# EAGLE design IO BOARD BOTTOM (EAGLE 9.6.2)
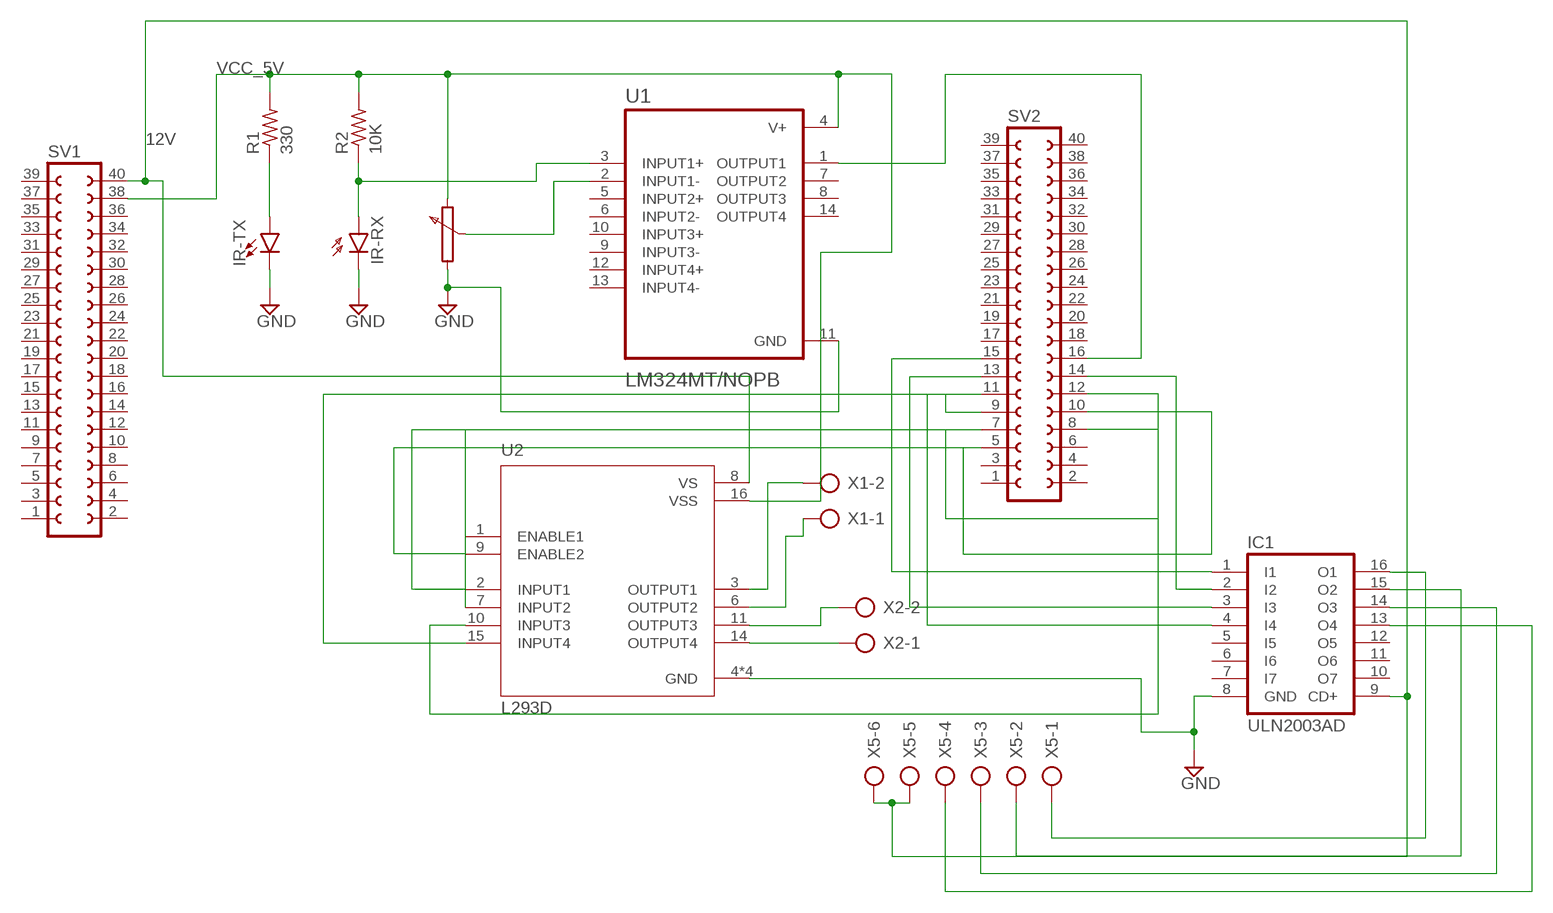
[diagram p0: schematic, sheet 1]

## Parts
IC1  ULN2003AD  [SO16]
IR-RX  SFH205  [SFH205]
IR-TX  LED-IRTSAL6100  [LED_5MM]
R1  330  R-US_0204/2V  [0204V]
R2  10K  R-US_0204/2V  [0204V]
SV1  FE20-2  [FE20-2]
SV2  FE20-2  [FE20-2]
U1  LM324MT/NOPB  [SOP65P640X120-14N]
U2  L293D  [DIP880W50P254L2000H510Q16]
X1  AK500/2  [AK500/2]
X2  AK500/2  [AK500/2]
X5  AK500/6  [AK500/6]

## Nets
12V: IC1.9(CD+) SV1.40 U2.8(VS) X5.5 X5.6
GND: IC1.8(GND) IR-RX.K(C) IR-TX.K(C) U1.11(GND) U2.4(GND) U2.5(GND) U2.12(GND) U2.13(GND)
N$1: IR-TX.A R1.1
N$2: IR-RX.A R2.1 U1.3(INPUT1+)
N$3: U1.2(INPUT1-)
N$4: SV2.16 U1.1(OUTPUT1)
N$5: SV2.8 U2.1(ENABLE1)
N$6: SV2.10 U2.9(ENABLE2)
N$7: SV2.7 U2.2(INPUT1)
N$8: SV2.5 U2.7(INPUT2)
N$9: SV2.12 U2.10(INPUT3)
N$10: SV2.9 U2.15(INPUT4)
N$11: U2.3(OUTPUT1) X1.2
N$12: U2.6(OUTPUT2) X1.1
N$13: U2.11(OUTPUT3) X2.2
N$14: U2.14(OUTPUT4) X2.1
N$15: IC1.1(I1) SV2.15
N$17: IC1.2(I2) SV2.14
N$18: IC1.3(I3) SV2.13
N$19: IC1.4(I4) SV2.11
N$20: IC1.16(O1) X5.1
N$21: IC1.15(O2) X5.2
N$22: IC1.14(O3) X5.3
N$23: IC1.13(O4) X5.4
VCC_5V: R1.2 R2.2 SV1.38 U1.4(V+) U2.16(VSS)
Unconnected: IC1.5(I5) IC1.6(I6) IC1.7(I7) IC1.10(O7) IC1.11(O6) IC1.12(O5) SV1.1 SV1.2 SV1.3 SV1.4 SV1.5 SV1.6 SV1.7 SV1.8 SV1.9 SV1.10 SV1.11 SV1.12 SV1.13 SV1.14 SV1.15 SV1.16 SV1.17 SV1.18 SV1.19 SV1.20 SV1.21 SV1.22 SV1.23 SV1.24 SV1.25 SV1.26 SV1.27 SV1.28 SV1.29 SV1.30 SV1.31 SV1.32 SV1.33 SV1.34 SV1.35 SV1.36 SV1.37 SV1.39 SV2.1 SV2.2 SV2.3 SV2.4 SV2.6 SV2.17 SV2.18 SV2.19 SV2.20 SV2.21 SV2.22 SV2.23 SV2.24 SV2.25 SV2.26 SV2.27 SV2.28 SV2.29 SV2.30 SV2.31 SV2.32 SV2.33 SV2.34 SV2.35 SV2.36 SV2.37 SV2.38 SV2.39 SV2.40 U1.5(INPUT2+) U1.6(INPUT2-) U1.7(OUTPUT2) U1.8(OUTPUT3) U1.9(INPUT3-) U1.10(INPUT3+) U1.12(INPUT4+) U1.13(INPUT4-) U1.14(OUTPUT4)

## Library data of the parts
IC1 = ULN2003A:ULN2003A: DRIVER ARRAY Check prices <https://pricing.snapeda.com/search/part/ULN2003A/?ref=eda>; AVAILABILITY: Good; DESCRIPTION: Bipolar (BJT) Transistor Array 7 NPN Darlington 50V 500mA Through Hole 16-DIP; MF: STMicroelectronics; MP: ULN2003A; PACKAGE: DIP-16 STMicroelectronics; PRICE: None; PURCHASE-URL: https://pricing.snapeda.com/search/part/ULN2003A/?ref=eda
IR-RX = opto-trans-siemens:SFH205: PHOTO DIODE; OC_FARNELL: unknown; OC_NEWARK: unknown
IR-TX = SparkFun-LED:LED-IR: Infrared LED (IR) Wavelength: 940nm Packages: TSAL6100 LTE302 - Side firing. Check SparkFun-Sensors.lbr for the receiver SparkFun Products: ZX Distance and Gesture Sensor <[https://www.sparkfun.com/products/12780]> Infrared Emitters and Detectors <https://www.sparkfun.com/products/241>; PROD_ID: DIO-12058
R1 R2 = rcl:R-US_: RESISTOR, American symbol; SPICEPREFIX: R
SV1 SV2 = con-lsta:FE20-2: FEMALE HEADER; OC_FARNELL: unknown; OC_NEWARK: unknown
U1 = LM324MT_NOPB:LM324MT/NOPB: Check prices <https://pricing.snapeda.com/search/part/LM324MT/?ref=eda>; AVAILABILITY: Bad; DESCRIPTION: General Purpose Amplifier 4 Circuit 14-TSSOP; MF: Texas Instruments; MP: LM324MT; PACKAGE: TSSOP-14 Texas Instruments; PRICE: None
U2 = L293D:L293D: 4-Channel Motor Driver 24V 16-Pin Power PDIP Tube Check prices <https://pricing.snapeda.com/search/part/L293D/?ref=eda>; AVAILABILITY: Good; DESCRIPTION: Bipolar Motor Driver Parallel 20-SOIC; MF: STMicroelectronics; MP: L293D; PACKAGE: DIP-16 STMicroelectronics; PRICE: None; PURCHASE-URL: https://pricing.snapeda.com/search/part/L293D/?ref=eda
X1 X2 = con-ptr500:AK500/2: CONNECTOR; OC_FARNELL: unknown; OC_NEWARK: unknown
X5 = con-ptr500:AK500/6: CONNECTOR; OC_FARNELL: unknown; OC_NEWARK: unknown

## Board
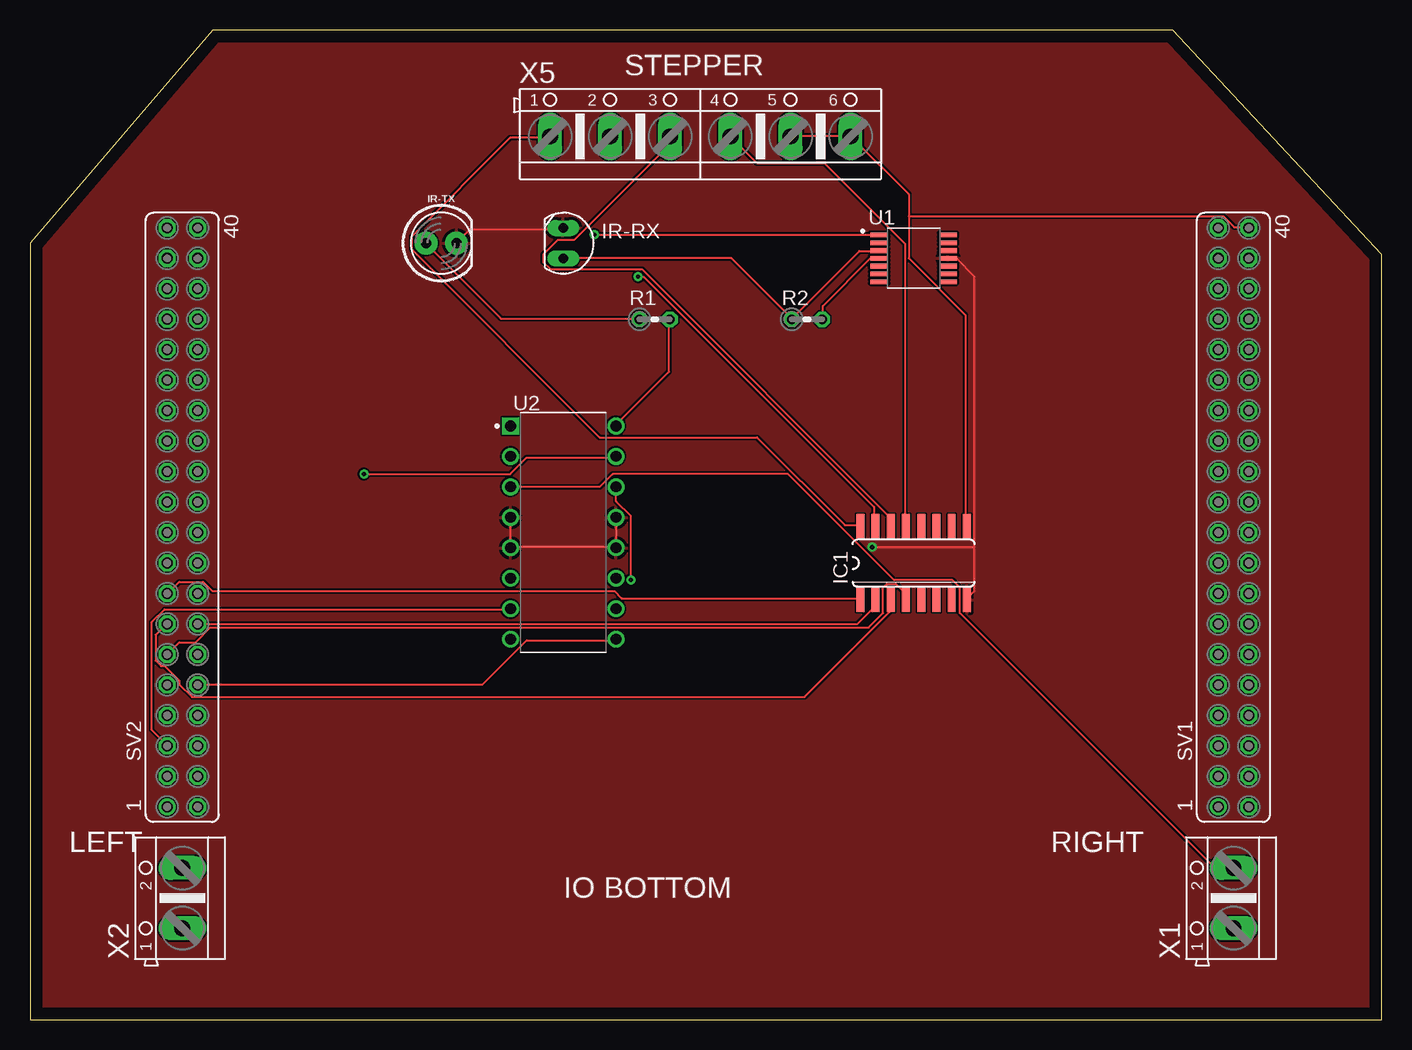
[diagram p1: board, top side]
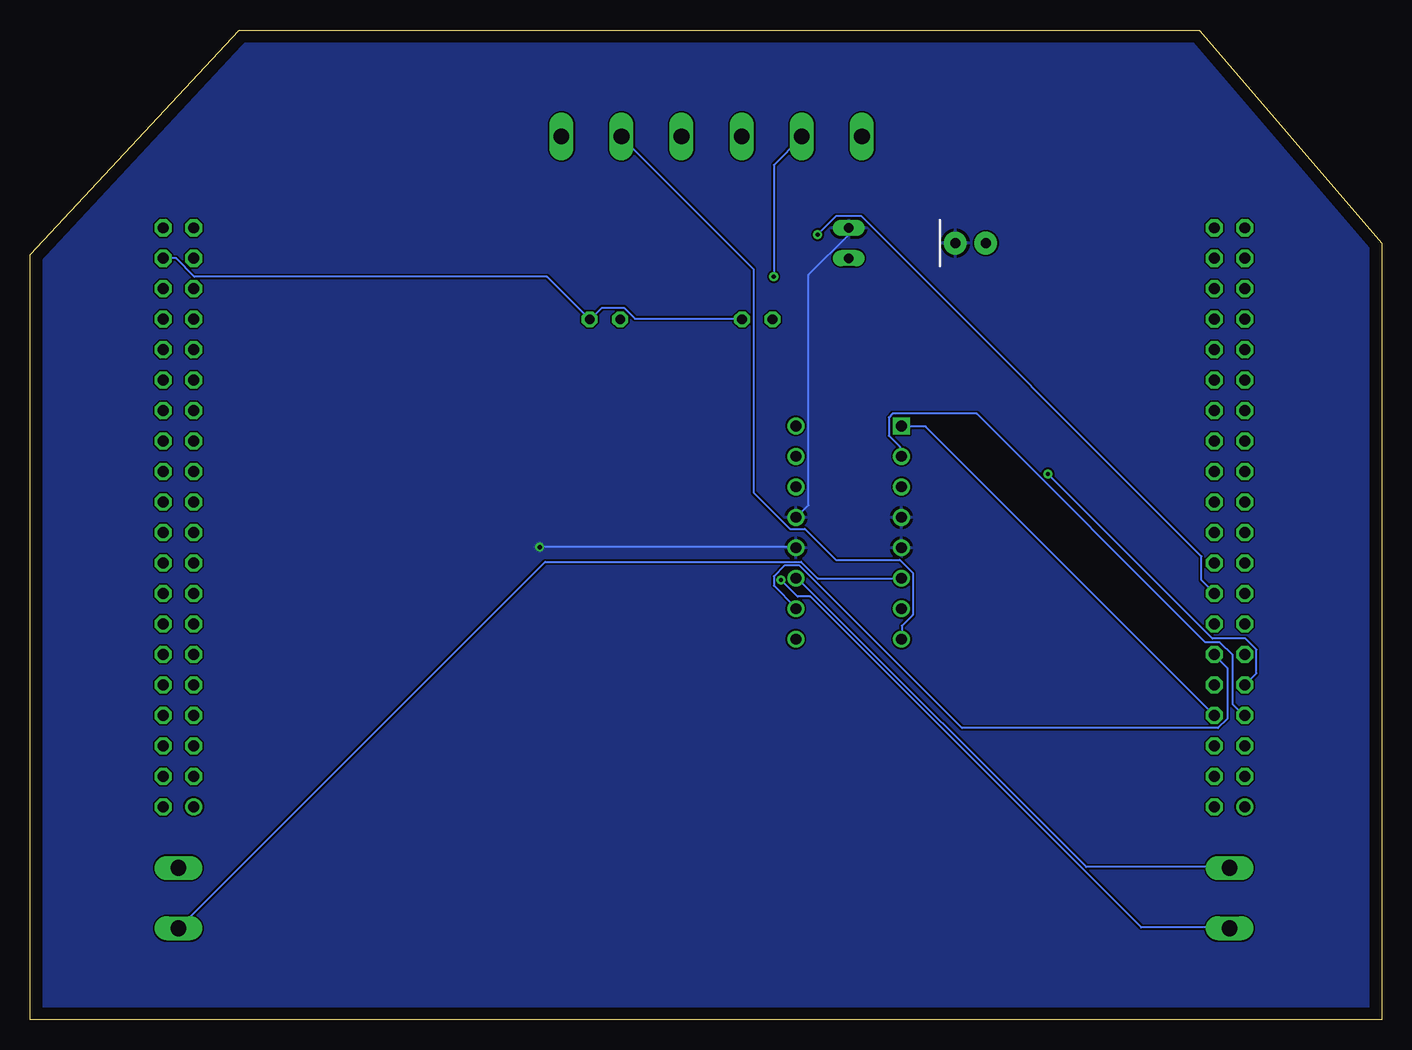
[diagram p2: board, bottom side, seen from below]

Size 112.7 x 82.54 mm. Coordinates in mm from the lower left corner, seen from the top.
Outline: 0,0 112.7,0 112.7,63.83 95.26,82.54 15.23,82.54 0,64.77 0,0
Copper layers (1*16): Top 0.035mm / dielectric 1.5mm / Bottom 0.035mm
Design rules "default": minimum track width 6mil, minimum drill 0.35mm, track to track 6mil, track to pad 6mil, pad to pad 6mil, via to via 6mil, smd to smd 6mil, copper to edge 40mil, drill to drill 6mil, minimum pad ring 10mil, minimum via ring 8mil, stop-mask expansion 4mil, vias tented up to drill 0mil, thermal gap 10mil

### Footprints (pad centres in the part's own frame; a part is rotated, then mirrored left to right if it is on the bottom)
SO16 = smd 0.66 x 2.032: 1 -4.445,-3.073; 2 -3.175,-3.073; 3 -1.905,-3.073; 4 -0.635,-3.073; 5 0.635,-3.073; 6 1.905,-3.073; 7 3.175,-3.073; 8 4.445,-3.073; 9 4.445,3.073; 10 3.175,3.073; 11 1.905,3.073; 12 0.635,3.073; 13 -0.635,3.073; 14 -1.905,3.073; 15 -3.175,3.073; 16 -4.445,3.073
SFH205 = drill 0.813 long: A 0,-1.27; K 0,1.27
LED_5MM = drill 0.813 pad 1.88: A -1.27,0; K 1.27,0
0204V = drill 0.813 octagon: 1 -1.27,0; 2 1.27,0
FE20-2 = drill 0.914: 1 -24.13,1.27 | drill 0.914 octagon: 2 -24.13,-1.27; 3 -21.59,1.27; 4 -21.59,-1.27; 5 -19.05,1.27; 6 -19.05,-1.27; 7 -16.51,1.27; 8 -16.51,-1.27; 9 -13.97,1.27; 10 -13.97,-1.27; 11 -11.43,1.27; 12 -11.43,-1.27; 13 -8.89,1.27; 14 -8.89,-1.27; 15 -6.35,1.27; 16 -6.35,-1.27; 17 -3.81,1.27; 18 -3.81,-1.27; 19 -1.27,1.27; 20 -1.27,-1.27; 21 1.27,1.27; 22 1.27,-1.27; 23 3.81,1.27; 24 3.81,-1.27; 25 6.35,1.27; 26 6.35,-1.27; 27 8.89,1.27; 28 8.89,-1.27; 29 11.43,1.27; 30 11.43,-1.27; 31 13.97,1.27; 32 13.97,-1.27; 33 16.51,1.27; 34 16.51,-1.27; 35 19.05,1.27; 36 19.05,-1.27; 37 21.59,1.27; 38 21.59,-1.27; 39 24.13,1.27; 40 24.13,-1.27
SOP65P640X120-14N = smd 1.57 x 0.41: 1 -2.87,1.95; 2 -2.87,1.3; 3 -2.87,0.65; 4 -2.87,0; 5 -2.87,-0.65; 6 -2.87,-1.3; 7 -2.87,-1.95; 8 2.87,-1.95; 9 2.87,-1.3; 10 2.87,-0.65; 11 2.87,0; 12 2.87,0.65; 13 2.87,1.3; 14 2.87,1.95
DIP880W50P254L2000H510Q16 = drill 0.9 pad 1.25 square: 1 -4.4,8.89 | drill 0.9 pad 1.25: 2 -4.4,6.35; 3 -4.4,3.81; 4 -4.4,1.27; 5 -4.4,-1.27; 6 -4.4,-3.81; 7 -4.4,-6.35; 8 -4.4,-8.89; 9 4.4,-8.89; 10 4.4,-6.35; 11 4.4,-3.81; 12 4.4,-1.27; 13 4.4,1.27; 14 4.4,3.81; 15 4.4,6.35; 16 4.4,8.89
AK500/2 = drill 1.321 long: 1 -2.515,0; 2 2.515,0
AK500/6 = drill 1.321 long: 1 -12.522,0; 2 -7.518,0; 3 -2.515,0; 4 2.515,0; 5 7.518,0; 6 12.522,0

### Placement (x,y rotation side)
IC1  73.66,38.1 0 top
IR-RX  44.45,64.77 0 top
IR-TX  34.29,64.77 0 top
R1  52.07,58.42 0 top
R2  64.77,58.42 0 top
SV1  100.33,41.91 90 top
SV2  12.7,41.91 90 top
U1  73.66,63.5 0 top
U2  44.45,40.64 0 top
X1  100.33,10.16 90 top
X2  12.7,10.16 90 top
X5  55.88,73.66 0 top

### Tracks (layer width: path | path; a pad name or v marks a point on that pad's centre or on a via)
12V
  Top 0.152: 73.25,67.01 73.25,68.83 68.53,73.56 X5.6 68.38,73.71 63.5,73.71 X5.5 | 73.25,67.01 73.25,63.5 77.98,58.78 77.98,41.25 IC1.9 | 73.25,67.01 99.47,67.01 100.38,66.09 101.6,66.09 SV1.40
  Bottom 0.152: U2.8 40.03,31.8 40.03,32.87 39.12,33.78 39.12,37.29 40.18,38.35 45.52,38.35 48.11,40.95 49.33,40.95 52.38,43.99 52.38,62.59 63.35,73.56 X5.5
GND  (via drill 0.35)
  Top 0.152: U1.11 77.22,63.5 78.74,61.98 78.74,39.42 | 78.74,39.42 78.74,35.76 78.13,35.15 IC1.8 | IR-RX.K 44.45,65.94 36.68,65.94 35.61,64.87 IR-TX.K | U2.4 40.03,41.86 40.03,39.42 U2.5 40.18,39.42 48.72,39.42 U2.12 48.87,39.42 48.87,41.86 U2.13 | v70.21,39.42 78.74,39.42
  Bottom 0.152: IR-RX.K 44.45,65.48 47.8,62.13 47.8,42.93 48.72,42.01 U2.13 | v70.21,39.42 48.87,39.42 U2.12
  pour Top: 11.43,85.09 111.76,85.09 121.92,74.93 121.92,-5.08 -2.54,-5.08 -10.16,2.54 -10.16,63.5
  pour Bottom: 8.89,88.9 118.11,88.9 132.08,74.93 132.08,-5.08 130.81,-6.35 128.27,-8.89 -8.89,-8.89 -16.51,-1.27 -16.51,63.5
N$1
  Top 0.152: R1.1 50.7,58.47 39.27,58.47 33.02,64.72 IR-TX.A
N$2
  Top 0.152: 63.5,58.47 69.14,64.11 70.66,64.11 U1.3 | IR-RX.A 58.47,63.5 63.5,58.47 | 63.5,58.47 R2.1
N$4  (via drill 0.35)
  Top 0.152: v47.04,65.48 70.66,65.48 U1.1
  Bottom 0.152: v47.04,65.48 45.52,67.01 43.38,67.01 15.04,38.66 15.04,36.68 13.97,35.61 SV2.16
N$5
  Bottom 0.152: SV2.8 38.05,49.48 40.03,49.48 U2.1
N$6
  Top 0.152: U2.9 48.72,31.65 41.4,31.65 37.74,27.99 13.97,27.99 SV2.10
N$7
  Bottom 0.152: U2.2 40.18,47.04 40.18,47.8 41.1,48.72 41.1,50.24 40.79,50.55 33.78,50.55 14.73,31.5 13.51,31.5 12.45,30.43 12.45,26.31 11.53,25.4 SV2.7
N$8
  Top 0.152: U2.7 40.03,34.24 11.23,34.24 10.16,33.17 10.16,24.18 11.38,22.96 SV2.5
N$9
  Bottom 0.152: U2.10 48.87,34.39 50.7,36.22 50.7,36.98 49.78,37.9 48.57,37.9 35,24.33 13.66,24.33 12.9,25.09 12.9,29.36 13.97,30.43 SV2.12
N$10  (via drill 0.35)
  Top 0.152: v27.84,45.52 40.03,45.52 41.4,46.89 48.72,46.89 U2.15
  Bottom 0.152: v27.84,45.52 14.12,31.8 11.38,31.8 10.46,30.89 10.46,28.9 SV2.9
N$11
  Top 0.152: U2.3 47.5,44.45 48.57,45.52 63.2,45.52 72.03,36.68 76.91,36.68 77.52,36.07 77.52,33.93 98.7,12.75 100.23,12.75 X1.2
N$12
  Bottom 0.152: U2.6 47.04,36.83 48.41,38.2 69.75,38.2 100.23,7.72 X1.1
N$13
  Bottom 0.152: U2.11 48.72,36.83 24.64,12.75 12.75,12.75 X2.2
N$14  (via drill 0.35)
  Top 0.152: v50.09,36.68 50.09,42.01 48.87,43.23 48.87,44.45 U2.14
  Bottom 0.152: v50.09,36.68 48.72,35.31 47.65,35.31 20.07,7.72 12.75,7.72 X2.1
N$15
  Top 0.152: IC1.1 69.14,35.15 49.33,35.15 48.72,35.76 15.19,35.76 14.43,36.52 12.45,36.52 11.53,35.61 SV2.15
N$17
  Top 0.152: SV2.14 68.99,33.02 70.36,34.39 70.36,35 IC1.2
N$18
  Top 0.152: IC1.3 71.73,35 71.73,34.09 64.57,26.92 13.51,26.92 12.45,27.99 12.45,28.3 11.23,29.52 10.92,29.52 10.46,29.97 10.46,32.11 11.38,33.02 SV2.13
N$19
  Top 0.152: SV2.11 12.45,31.5 13.82,31.5 15.04,32.72 69.9,32.72 71.12,33.93 71.12,36.07 71.42,36.37 72.19,36.37 72.95,35.61 72.95,35.15 IC1.4
N$20
  Top 0.152: IC1.16 69.14,41.25 67.92,41.25 60.6,48.56 47.5,48.56 31.8,64.26 31.8,65.33 40.03,73.56 43.23,73.56 X5.1
N$21  (via drill 0.35)
  Top 0.152: v50.7,61.98 51.16,61.98 70.36,42.77 70.36,41.25 IC1.15
  Bottom 0.152: v50.7,61.98 50.7,71.27 48.41,73.56 X5.2
N$22
  Top 0.152: IC1.14 71.73,41.25 71.73,41.86 51,62.59 43.38,62.59 42.77,63.2 42.77,63.8 43.99,65.02 45.36,65.02 53.29,72.95 53.29,73.56 X5.3
N$23
  Top 0.152: IC1.13 72.95,41.25 72.95,64.72 66.24,71.43 60.6,71.43 58.47,73.56 X5.4
VCC_5V
  Top 0.152: R1.2 53.29,58.32 53.29,54.05 48.87,49.63 U2.16 | U1.4 70.05,63.5 66.09,59.54 66.09,58.47 R2.2
  Bottom 0.152: SV1.38 100.53,63.5 99.01,61.98 69.6,61.98 R2.2 65.94,58.47 65.02,59.38 63.2,59.38 62.28,58.47 53.44,58.47 R1.2

### Text on the board
tPlace: STEPPER | LEFT | RIGHT | IO BOTTOM